# EAGLE design RamBoard (EAGLE 5.11)
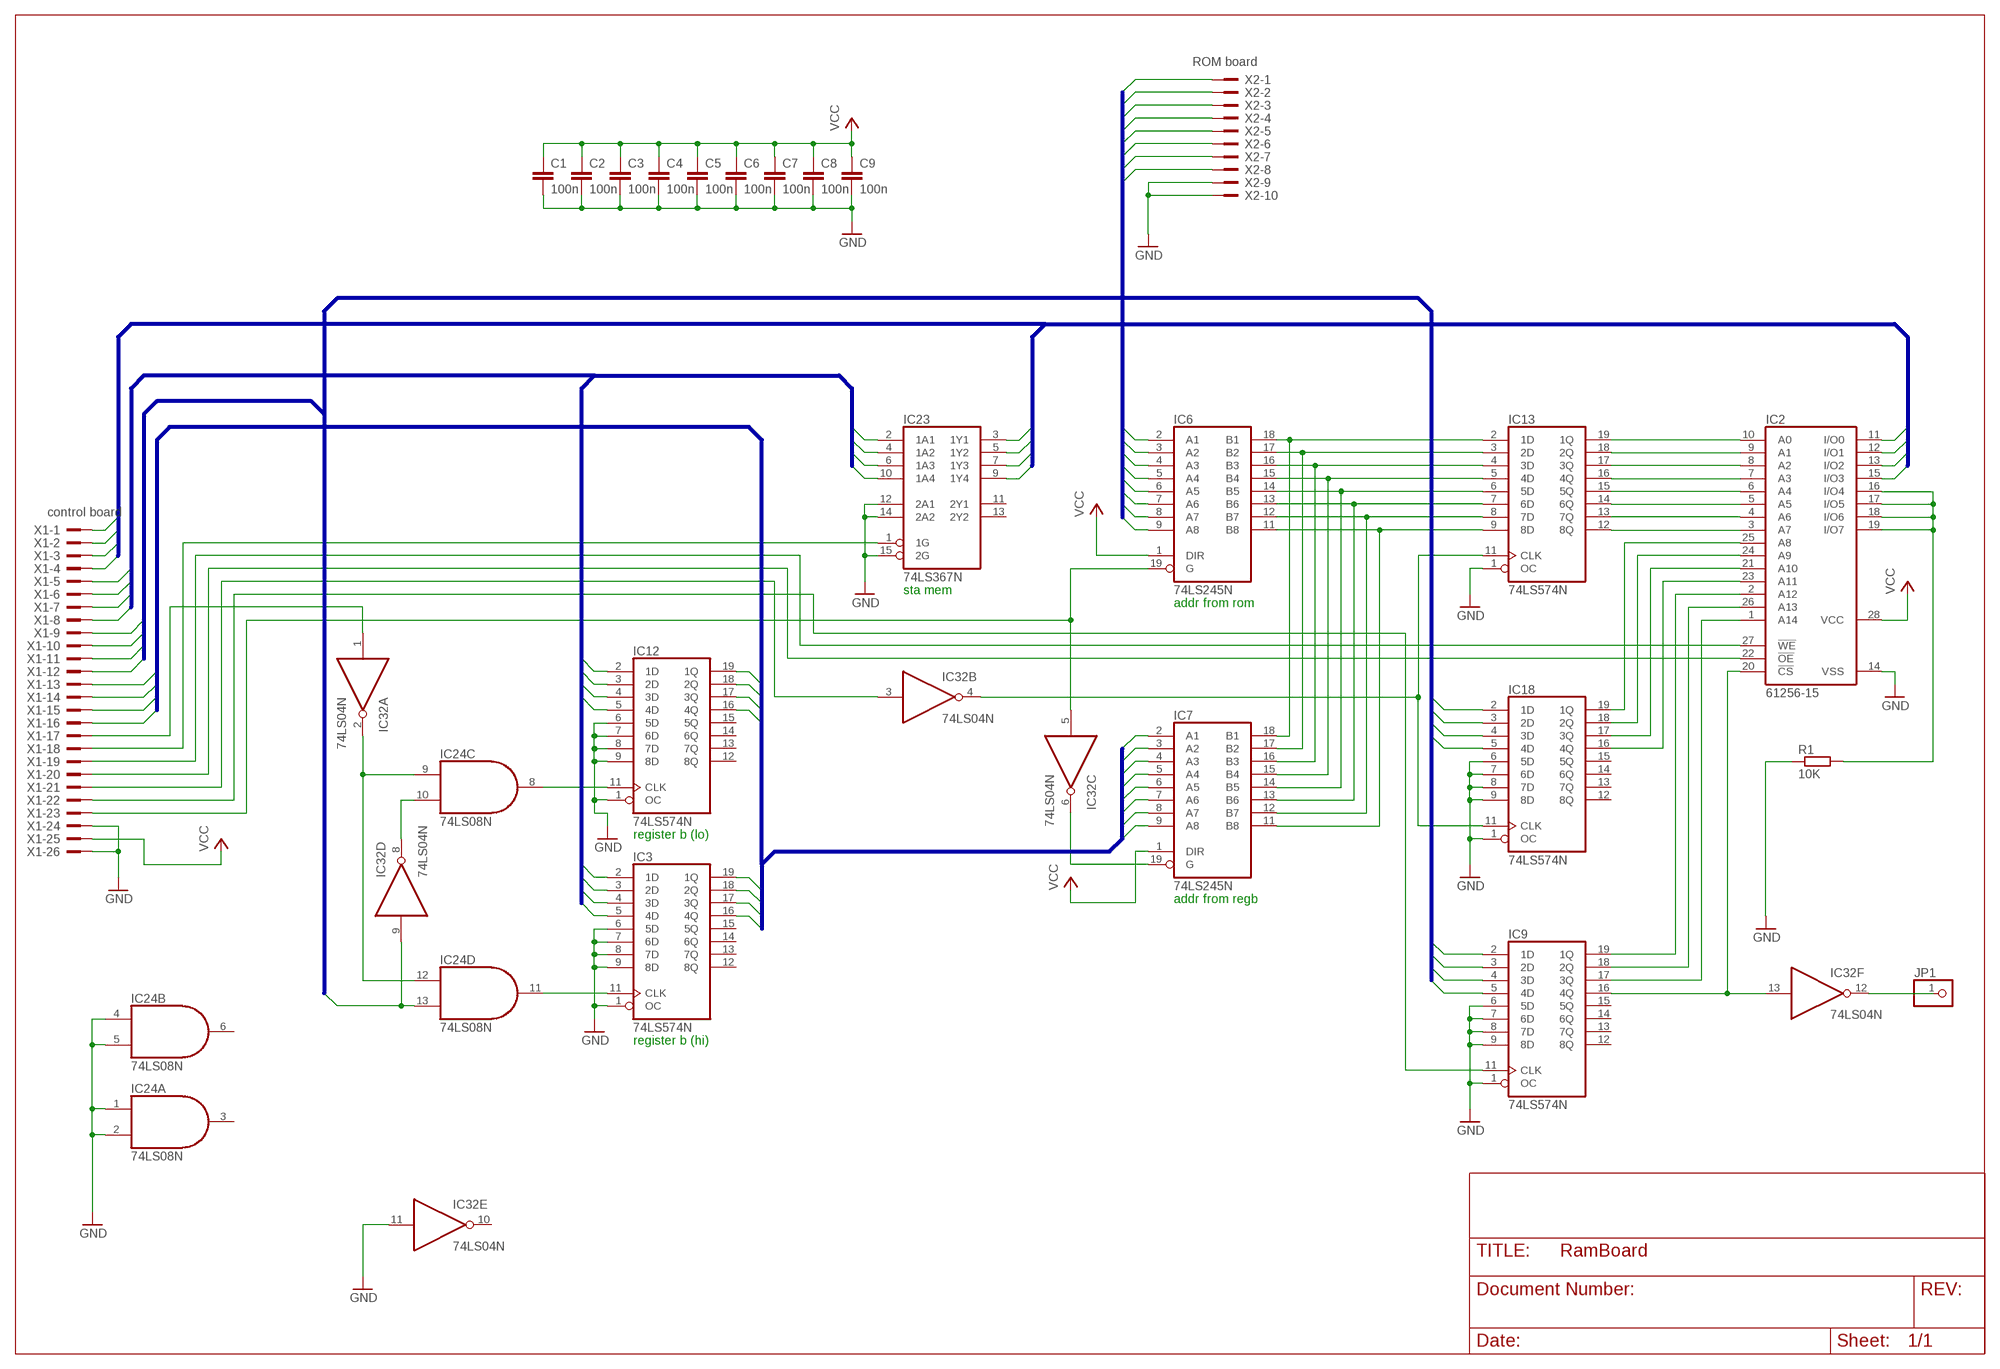
[diagram p0: schematic, sheet 1]

## Parts
C1  100n  C-EU050-025X075  [C050-025X075]
C2  100n  C-EU050-025X075  [C050-025X075]
C3  100n  C-EU050-025X075  [C050-025X075]
C4  100n  C-EU050-025X075  [C050-025X075]
C5  100n  C-EU050-025X075  [C050-025X075]
C6  100n  C-EU050-025X075  [C050-025X075]
C7  100n  C-EU050-025X075  [C050-025X075]
C8  100n  C-EU050-025X075  [C050-025X075]
C9  100n  C-EU050-025X075  [C050-025X075]
IC2  61256-15  62832P  [DIL28-3]
IC3  74LS574N  74AS574N  [DIL20]
IC6  74LS245N  [DIL20]
IC7  74LS245N  [DIL20]
IC9  74LS574N  74AS574N  [DIL20]
IC12  74LS574N  74AS574N  [DIL20]
IC13  74LS574N  74AS574N  [DIL20]
IC18  74LS574N  74AS574N  [DIL20]
IC23  74LS367N  74367N  [DIL16]
IC24  74LS08N  [DIL14]
IC32  74LS04N  [DIL14]
JP1  PINHD-1X1  [1X01]
R1  10K  R-EU_0207/10  [0207/10]
X1  control board  2526-  [PAK100/2500-26]
X2  ROM board  2510-  [PAK100/2500-10]

## Nets
/ADDR_FROM_REGB: IC7.19(G) IC32.6(C:O)
/CS0: IC2.20(!CS) IC9.16(4Q) IC32.13(F:I)
/CS1: IC32.12(F:O) JP1.1
/IMM0: IC24.10(C:I1) IC32.8(D:O)
/LOAD_MEMADDR: IC32.3(B:I) X1.21
/LOAD_REGB: IC32.1(A:I) X1.17
/RAM_OE: IC2.22(!OE) X1.20
/RAM_WE: IC2.27(!WE) X1.19
/STA_MEM: IC23.1(1G) X1.18
ACCOUT0: IC3.2(1D) IC12.2(1D) IC23.2(1A1) X1.5
ACCOUT1: IC3.3(2D) IC12.3(2D) IC23.4(1A2) X1.6
ACCOUT2: IC3.4(3D) IC12.4(3D) IC23.6(1A3) X1.7
ACCOUT3: IC3.5(4D) IC12.5(4D) IC23.10(1A4) X1.8
ADDR_FROM_REGB: IC6.19(G) IC32.5(C:I) X1.23
GND: C1.2 C2.2 C3.2 C4.2 C5.2 C6.2 C7.2 C8.2 C9.2 IC2.14(VSS) IC3.1(OC) IC3.6(5D) IC3.7(6D) IC3.8(7D) IC3.9(8D) IC9.1(OC) IC9.6(5D) IC9.7(6D) IC9.8(7D) IC9.9(8D) IC12.1(OC) IC12.6(5D) IC12.7(6D) IC12.8(7D) IC12.9(8D) IC13.1(OC) IC18.1(OC) IC18.6(5D) IC18.7(6D) IC18.8(7D) IC18.9(8D) IC23.12(2A1) IC23.14(2A2) IC23.15(2G) IC24.1(A:I0) IC24.2(A:I1) IC24.4(B:I0) IC24.5(B:I1) IC32.11(E:I) R1.1 X1.24 X1.26 X2.9 X2.10
IMM0: IC9.2(1D) IC18.2(1D) IC24.13(D:I1) IC32.9(D:I) X1.9
IMM1: IC9.3(2D) IC18.3(2D) X1.10
IMM2: IC9.4(3D) IC18.4(3D) X1.11
IMM3: IC9.5(4D) IC18.5(4D) X1.12
LOAD_MEMADDR: IC13.11(CLK) IC18.11(CLK) IC32.4(B:O)
LOAD_MEMADDR_H: IC9.11(CLK) X1.22
LOAD_RAM_A0: IC6.18(B1) IC7.18(B1) IC13.2(1D)
LOAD_RAM_A1: IC6.17(B2) IC7.17(B2) IC13.3(2D)
LOAD_RAM_A2: IC6.16(B3) IC7.16(B3) IC13.4(3D)
LOAD_RAM_A3: IC6.15(B4) IC7.15(B4) IC13.5(4D)
LOAD_RAM_A4: IC6.14(B5) IC7.14(B5) IC13.6(5D)
LOAD_RAM_A5: IC6.13(B6) IC7.13(B6) IC13.7(6D)
LOAD_RAM_A6: IC6.12(B7) IC7.12(B7) IC13.8(7D)
LOAD_RAM_A7: IC6.11(B8) IC7.11(B8) IC13.9(8D)
LOAD_REGB: IC24.9(C:I0) IC24.12(D:I0) IC32.2(A:O)
LOAD_REGB_HI: IC3.11(CLK) IC24.11(D:O)
LOAD_REGB_LO: IC12.11(CLK) IC24.8(C:O)
N$1: IC2.10(A0) IC13.19(1Q)
N$2: IC2.2(A12) IC9.19(1Q)
N$3: IC2.9(A1) IC13.18(2Q)
N$4: IC2.26(A13) IC9.18(2Q)
N$5: IC2.8(A2) IC13.17(3Q)
N$6: IC2.7(A3) IC13.16(4Q)
N$7: IC2.6(A4) IC13.15(5Q)
N$8: IC2.5(A5) IC13.14(6Q)
N$9: IC2.4(A6) IC13.13(7Q)
N$10: IC2.3(A7) IC13.12(8Q)
N$13: IC2.25(A8) IC18.19(1Q)
N$14: IC2.24(A9) IC18.18(2Q)
N$15: IC2.1(A14) IC9.17(3Q)
N$17: IC2.21(A10) IC18.17(3Q)
N$18: IC2.23(A11) IC18.16(4Q)
RAM_IO0: IC2.11(I/O0) IC23.3(1Y1) X1.1
RAM_IO1: IC2.12(I/O1) IC23.5(1Y2) X1.2
RAM_IO2: IC2.13(I/O2) IC23.7(1Y3) X1.3
RAM_IO3: IC2.15(I/O3) IC23.9(1Y4) X1.4
RAM_IO4..7: IC2.16(I/O4) IC2.17(I/O5) IC2.18(I/O6) IC2.19(I/O7) R1.2
REGB0: IC7.2(A1) IC12.19(1Q) X1.13
REGB1: IC7.3(A2) IC12.18(2Q) X1.14
REGB2: IC7.4(A3) IC12.17(3Q) X1.15
REGB3: IC7.5(A4) IC12.16(4Q) X1.16
REGB4: IC3.19(1Q) IC7.6(A5)
REGB5: IC3.18(2Q) IC7.7(A6)
REGB6: IC3.17(3Q) IC7.8(A7)
REGB7: IC3.16(4Q) IC7.9(A8)
ROM_O0: IC6.2(A1) X2.1
ROM_O1: IC6.3(A2) X2.2
ROM_O2: IC6.4(A3) X2.3
ROM_O3: IC6.5(A4) X2.4
ROM_O4: IC6.6(A5) X2.5
ROM_O5: IC6.7(A6) X2.6
ROM_O6: IC6.8(A7) X2.7
ROM_O7: IC6.9(A8) X2.8
VCC: C1.1 C2.1 C3.1 C4.1 C5.1 C6.1 C7.1 C8.1 C9.1 IC2.28(VCC) IC6.1(DIR) IC7.1(DIR) X1.25
Unconnected: IC3.12(8Q) IC3.13(7Q) IC3.14(6Q) IC3.15(5Q) IC9.12(8Q) IC9.13(7Q) IC9.14(6Q) IC9.15(5Q) IC12.12(8Q) IC12.13(7Q) IC12.14(6Q) IC12.15(5Q) IC18.12(8Q) IC18.13(7Q) IC18.14(6Q) IC18.15(5Q) IC23.11(2Y1) IC23.13(2Y2) IC24.3(A:O) IC24.6(B:O) IC32.10(E:O)

## Buses
ROM_O[0..7]
RAM_IO[0..3]
ACCOUT[0..3]
REGB[0..7]
IMM[0..3]

## Notes on the sheet
- sta mem
- addr from rom
- register b (lo)
- addr from regb
- register b (hi)

## Power pins joined to a net without a drawn wire
GND: IC3.10(GND) IC6.10(GND) IC7.10(GND) IC9.10(GND) IC12.10(GND) IC13.10(GND) IC18.10(GND) IC23.8(GND) IC24.7(P:GND) IC32.7(P:GND)
VCC: IC3.20(VCC) IC6.20(VCC) IC7.20(VCC) IC9.20(VCC) IC12.20(VCC) IC13.20(VCC) IC18.20(VCC) IC23.16(VCC) IC24.14(P:VCC) IC32.14(P:VCC)

## Library data of the parts
C1-C9 = rcl:C-EU: CAPACITOR, European symbol
IC2 = memory-hitachi:62832P: MEMORY; OC_FARNELL: unknown; OC_NEWARK: unknown
IC3 IC9 IC12 IC13 IC18 = 74xx-us:74*574: 8-bit D type FLIP FLOP bus driver
IC6 IC7 = 74xx-us:74*245: Octal BUS TRANSCEIVER, 3-state
IC23 = 74xx-us:74*367: Hex BUS DRIVER, 3-state
IC24 = 74xx-us:74*08: Quad 2-input AND gate
IC32 = 74xx-us:74*04: Hex INVERTER
JP1 = pinhead:PINHD-1X1: PIN HEADER
R1 = rcl:R-EU_: RESISTOR, European symbol
X1 = con-3m:2526-: 3M (TM) Pak 100 4-Wall Header Source: 3M; OC_FARNELL: unknown; OC_NEWARK: unknown
X2 = con-3m:2510-: 3M (TM) Pak 100 4-Wall Header Source: 3M; MF: 3M; MPN: 2510-6002UB; OC_FARNELL: 9838244; OC_NEWARK: 46F4725

## Board
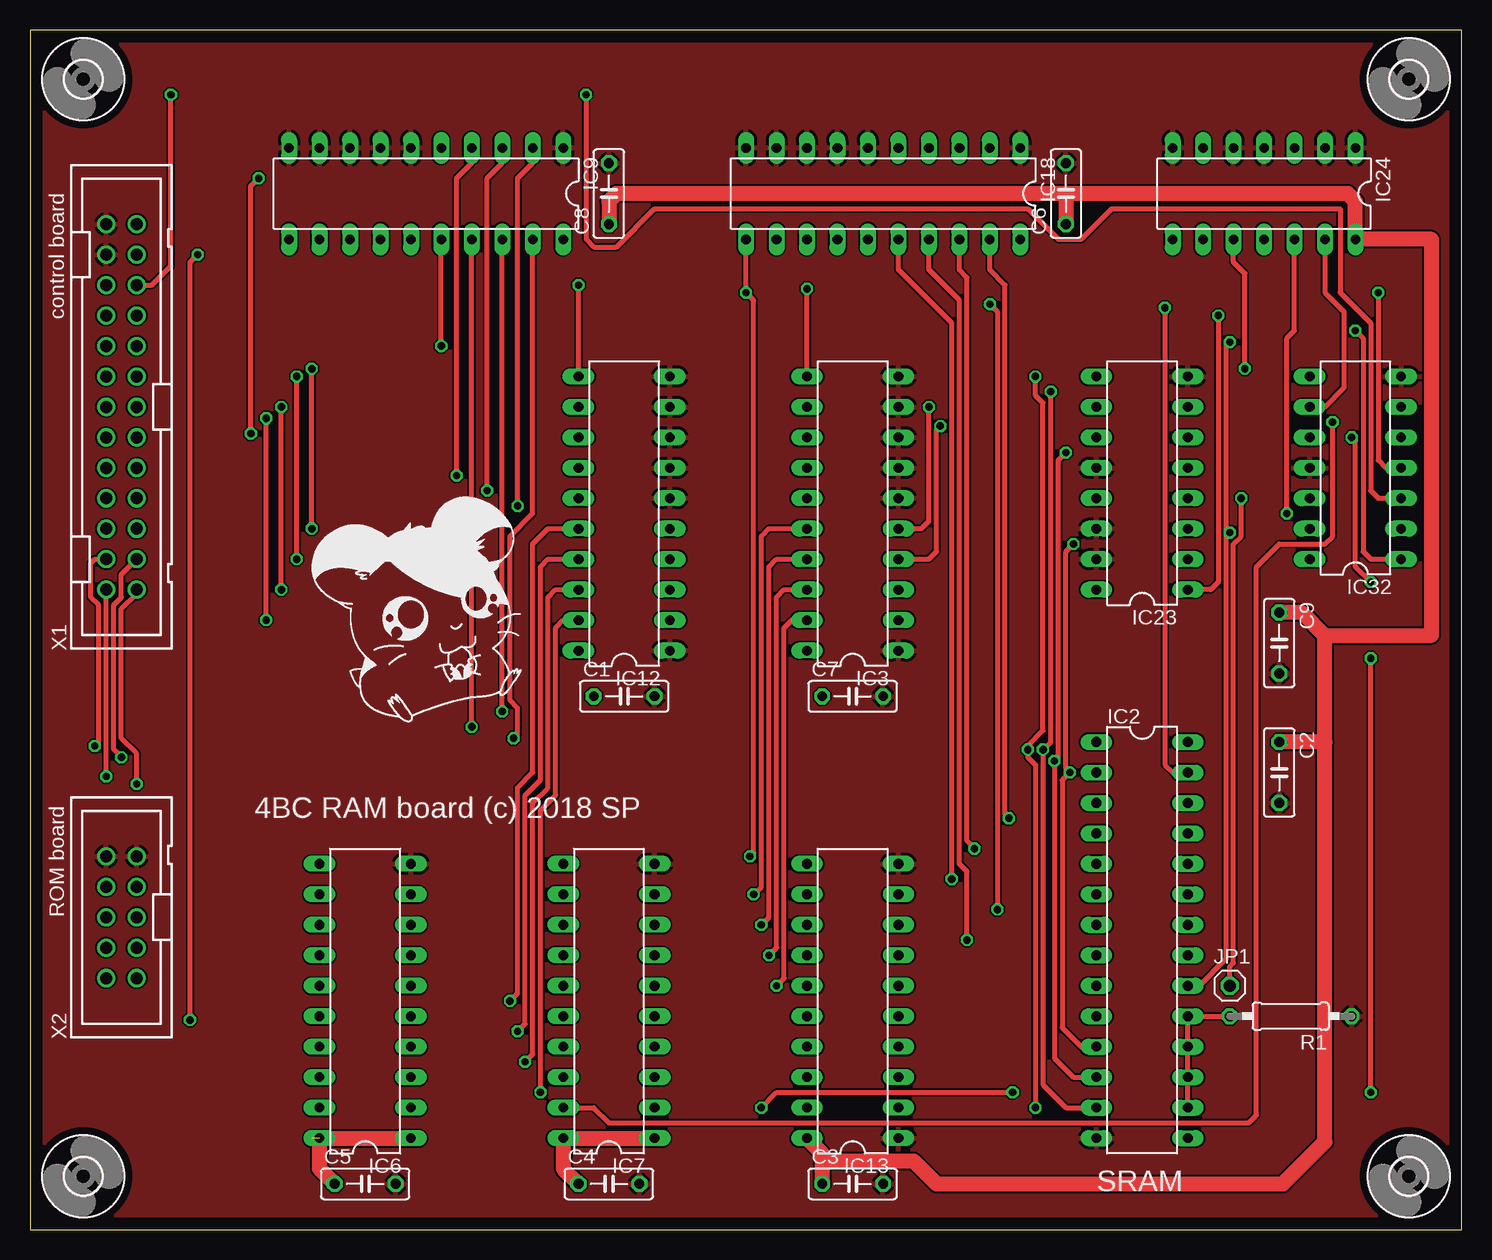
[diagram p1: board, top side]
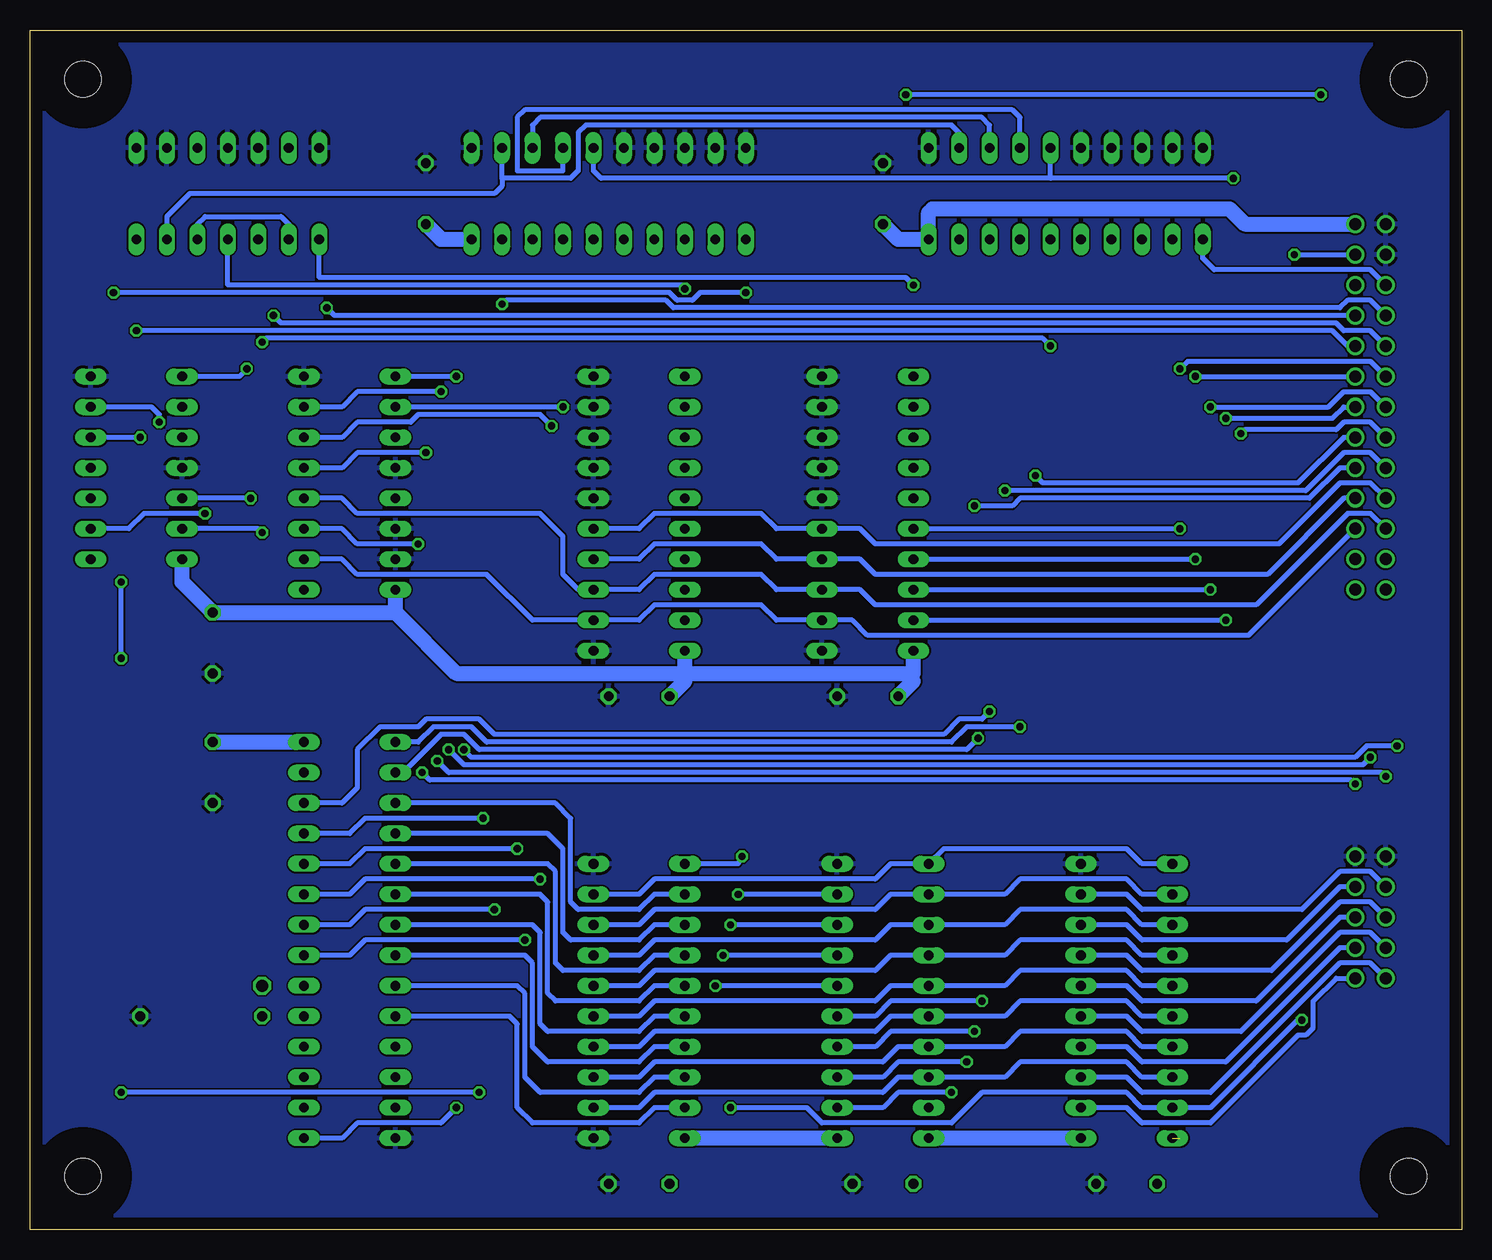
[diagram p2: board, bottom side, seen from below]

Size 119.36 x 100 mm. Coordinates in mm from the lower left corner, seen from the top.
Outline: 0,0 119.36,0 119.36,100 0,100 0,0
Copper layers (1*16): Top 0.035mm / dielectric 1.5mm / Bottom 0.035mm
Design rules "default *": minimum track width 10mil, minimum drill 16mil, track to track 6mil, track to pad 6mil, pad to pad 8mil, via to via 8mil, smd to smd 8mil, copper to edge 40mil, drill to drill 8mil, minimum pad ring 10mil, minimum via ring 8mil, stop-mask expansion 4mil, vias tented up to drill 0mil, thermal gap 10mil

### Footprints (pad centres in the part's own frame; a part is rotated, then mirrored left to right if it is on the bottom)
C050-025X075 = drill 0.813 octagon: 1 -2.54,0; 2 2.54,0
DIL28-3 = drill 0.813 long: 1 -16.51,-3.81; 2 -13.97,-3.81; 3 -11.43,-3.81; 4 -8.89,-3.81; 5 -6.35,-3.81; 6 -3.81,-3.81; 7 -1.27,-3.81; 8 1.27,-3.81; 9 3.81,-3.81; 10 6.35,-3.81; 11 8.89,-3.81; 12 11.43,-3.81; 13 13.97,-3.81; 14 16.51,-3.81; 15 16.51,3.81; 16 13.97,3.81; 17 11.43,3.81; 18 8.89,3.81; 19 6.35,3.81; 20 3.81,3.81; 21 1.27,3.81; 22 -1.27,3.81; 23 -3.81,3.81; 24 -6.35,3.81; 25 -8.89,3.81; 26 -11.43,3.81; 27 -13.97,3.81; 28 -16.51,3.81
DIL20 = drill 0.813 long: 1 -11.43,-3.81; 2 -8.89,-3.81; 3 -6.35,-3.81; 4 -3.81,-3.81; 5 -1.27,-3.81; 6 1.27,-3.81; 7 3.81,-3.81; 8 6.35,-3.81; 9 8.89,-3.81; 10 11.43,-3.81; 11 11.43,3.81; 12 8.89,3.81; 13 6.35,3.81; 14 3.81,3.81; 15 1.27,3.81; 16 -1.27,3.81; 17 -3.81,3.81; 18 -6.35,3.81; 19 -8.89,3.81; 20 -11.43,3.81
DIL16 = drill 0.813 long: 1 -8.89,-3.81; 2 -6.35,-3.81; 3 -3.81,-3.81; 4 -1.27,-3.81; 5 1.27,-3.81; 6 3.81,-3.81; 7 6.35,-3.81; 8 8.89,-3.81; 9 8.89,3.81; 10 6.35,3.81; 11 3.81,3.81; 12 1.27,3.81; 13 -1.27,3.81; 14 -3.81,3.81; 15 -6.35,3.81; 16 -8.89,3.81
DIL14 = drill 0.813 long: 1 -7.62,-3.81; 2 -5.08,-3.81; 3 -2.54,-3.81; 4 0,-3.81; 5 2.54,-3.81; 6 5.08,-3.81; 7 7.62,-3.81; 8 7.62,3.81; 9 5.08,3.81; 10 2.54,3.81; 11 0,3.81; 12 -2.54,3.81; 13 -5.08,3.81; 14 -7.62,3.81
1X01 = drill 1.016 octagon: 1 0,0
0207/10 = drill 0.813 octagon: 1 -5.08,0; 2 5.08,0
3,0 = hole 3: 0,0
PAK100/2500-26 = drill 1 pad 1.422 round: 1 -15.24,-1.27; 2 -15.24,1.27; 3 -12.7,-1.27; 4 -12.7,1.27; 5 -10.16,-1.27; 6 -10.16,1.27; 7 -7.62,-1.27; 8 -7.62,1.27; 9 -5.08,-1.27; 10 -5.08,1.27; 11 -2.54,-1.27; 12 -2.54,1.27; 13 0,-1.27; 14 0,1.27; 15 2.54,-1.27; 16 2.54,1.27; 17 5.08,-1.27; 18 5.08,1.27; 19 7.62,-1.27; 20 7.62,1.27; 21 10.16,-1.27; 22 10.16,1.27; 23 12.7,-1.27; 24 12.7,1.27; 25 15.24,-1.27; 26 15.24,1.27
PAK100/2500-10 = drill 1 pad 1.422 round: 1 -5.08,-1.27; 2 -5.08,1.27; 3 -2.54,-1.27; 4 -2.54,1.27; 5 0,-1.27; 6 0,1.27; 7 2.54,-1.27; 8 2.54,1.27; 9 5.08,-1.27; 10 5.08,1.27

### Placement (x,y rotation side)
C1  49.53,44.45 0 top
C2  104.14,38.1 270 top
C3  68.58,3.81 0 top
C4  48.26,3.81 0 top
C5  27.94,3.81 0 top
C6  86.36,86.36 90 top
C7  68.58,44.45 0 top
C8  48.26,86.36 90 top
C9  104.14,48.9 270 top
IC2  92.71,24.13 270 top
IC3  68.58,59.69 90 top
IC6  27.94,19.05 90 top
IC7  48.26,19.05 90 top
IC9  33.02,86.36 180 top
IC12  49.53,59.69 90 top
IC13  68.58,19.05 90 top
IC18  71.12,86.36 180 top
IC23  92.71,62.23 90 top
IC24  102.87,86.36 180 top
IC32  110.49,63.5 90 top
JP1  100.01,20.32 0 top
R1  105.09,17.78 180 top
U$1  [3,0]  114.94,95.89 0 top
U$2  [3,0]  4.45,95.89 0 top
U$3  [3,0]  4.45,4.45 0 top
U$4  [3,0]  114.94,4.45 0 top
X1  7.62,68.58 90 top
X2  7.62,26.04 90 top

### Tracks (layer width: path | path; a pad name or v marks a point on that pad's centre or on a via)
/ADDR_FROM_REGB  (via drill 0.6)
  Top 0.406: IC7.19 46.99,10.16 48.26,8.89 101.6,8.89 102.23,9.53 102.23,55.24 104.14,57.15 107.95,57.15 108.58,57.78 v108.58,67.31
  Bottom 0.406: v108.58,67.31 108.58,67.94 109.22,68.58 IC32.6
/CS0  (via drill 0.6)
  Top 0.406: IC2.20 97.47,20.32 99.69,22.54 99.69,57.78 v100.01,58.1 99.69,58.42 99.69,73.66 v100.01,73.98 | v34.29,73.66 IC9.16
  Bottom 0.406: IC32.13 100.33,58.42 v100.01,58.1 | v34.29,73.66 34.92,74.3 99.69,74.3 v100.01,73.98
/CS1  (via drill 0.6)
  Top 0.406: JP1.1 100.01,21.91 100.33,22.23 100.33,57.15 100.97,57.78 v100.97,60.96
  Bottom 0.406: v100.97,60.96 IC32.12
/IMM0  (via drill 0.6)
  Top 0.406: v101.28,71.75 101.28,79.69 100.33,80.64 IC24.10
  Bottom 0.406: IC32.8 101.92,71.12 v101.28,71.75
/LOAD_MEMADDR  (via drill 0.6)
  Top 0.406: IC32.3 112.39,60.96 111.76,61.59 111.76,75.56 109.22,78.11 109.22,85.09 90.17,85.09 87.63,82.55 85.72,82.55 83.19,85.09 52.07,85.09 48.9,81.92 46.99,81.92 46.35,82.55 v46.35,94.61 | X1.21 10.16,78.74 11.75,80.33 v11.75,94.61
  Bottom 0.406: v11.75,94.61 v46.35,94.61
/LOAD_REGB  (via drill 0.6)
  Top 0.406: v110.49,74.93 111.12,74.3 111.12,56.52 111.76,55.88 IC32.1
  Bottom 0.406: v110.49,74.93 10.79,74.93 9.53,73.66 X1.17
/RAM_OE  (via drill 0.6)
  Top 0.406: v80.64,26.67 80.64,76.52 v80.01,77.15
  Bottom 0.406: IC2.22 92.71,25.4 91.44,26.67 v80.64,26.67 | v80.01,77.15 79.69,77.47 66.36,77.47 65.72,76.83 10.16,76.83 9.53,77.47 7.62,77.47 X1.20
/RAM_WE  (via drill 0.6)
  Top 0.406: v94.61,76.83 94.61,38.73 95.25,38.1 IC2.27
  Bottom 0.406: v94.61,76.83 93.98,76.2 X1.19
/STA_MEM  (via drill 0.6)
  Top 0.406: v99.06,76.2 99.06,53.98 98.42,53.34 IC23.1
  Bottom 0.406: v99.06,76.2 98.42,75.56 10.48,75.56 9.84,74.93 7.62,74.93 X1.18
ACCOUT0
  Bottom 0.406: IC23.2 93.34,55.88 92.08,54.61 81.28,54.61 77.47,50.8 IC3.2 68.58,50.8 67.31,52.07 58.42,52.07 57.15,50.8 IC12.2 50.8,50.8 49.53,49.53 17.78,49.53 X1.5
ACCOUT1
  Bottom 0.406: IC23.4 93.34,60.96 92.08,59.69 76.83,59.69 74.93,57.78 74.93,54.61 73.66,53.34 IC3.3 68.58,53.34 67.31,54.61 58.42,54.61 57.15,53.34 IC12.3 50.16,53.34 48.9,52.07 17.14,52.07 9.53,59.69 7.62,59.69 X1.6
ACCOUT2  (via drill 0.6)
  Top 0.406: v75.88,66.99 75.56,66.67 75.56,56.52 74.93,55.88 IC3.4
  Bottom 0.406: IC3.4 68.58,55.88 67.31,57.15 58.42,57.15 57.15,55.88 IC12.4 50.16,55.88 48.9,54.61 16.19,54.61 9.84,60.96 X1.7 | IC23.6 93.34,66.04 92.08,67.31 87.63,67.31 87,67.94 76.83,67.94 v75.88,66.99
ACCOUT3  (via drill 0.6)
  Top 0.406: v74.93,68.58 74.93,59.05 74.3,58.42 IC3.5
  Bottom 0.406: IC3.5 68.58,58.42 67.31,59.69 58.42,59.69 57.15,58.42 IC12.5 50.16,58.42 48.9,57.15 15.24,57.15 10.16,62.23 7.62,62.23 X1.8 | v74.93,68.58 IC23.10
ADDR_FROM_REGB  (via drill 0.6)
  Top 0.406: v13.34,17.46 13.34,80.64 v13.97,81.28 | v60.96,10.16 62.23,11.43 v81.92,11.43 | v111.76,53.98 110.49,55.24 110.49,65.72 v110.17,66.04 | v111.76,11.43 v111.76,47.62
  Bottom 0.406: v13.34,17.46 13.65,17.46 20.95,10.16 IC6.19 26.67,10.16 27.94,11.43 40.01,11.43 42.55,8.89 53.34,8.89 54.61,10.16 v60.96,10.16 | v81.92,11.43 v111.76,11.43 | v110.17,66.04 IC32.5 | v111.76,47.62 v111.76,53.98 | v13.97,81.28 X1.23
GND
  pour Bottom: 0,100.33 119.38,100.33 119.38,0 0,0
  pour Top: 0,99.69 119.38,99.69 119.38,0 0,0
IMM0  (via drill 0.6)
  Top 0.406: IC24.13 107.95,78.11 109.54,76.52 109.54,70.17 107.95,68.58 IC32.9 | IC9.2 41.91,88.9 40.64,87.63 v40.64,60.33
  Bottom 0.406: v40.64,60.33 37.47,60.33 36.83,60.96 12.7,60.96 10.16,63.5 X1.9 | IC24.13 107.95,84.45 106.05,86.36 80.64,86.36 80.01,87 80.01,87.63 | IC9.2 41.91,91.44 42.55,92.08 73.03,92.08 73.66,91.44 73.66,88.27 74.3,87.63 80.01,87.63 | 80.01,87.63 IC18.2
IMM1  (via drill 0.6)
  Top 0.406: IC9.3 39.37,88.9 38.1,87.63 v38.1,61.59
  Bottom 0.406: IC9.3 39.37,92.08 40.01,92.71 76.83,92.71 77.47,92.08 IC18.3 | v38.1,61.59 13.02,61.59 9.84,64.77 7.62,64.77 X1.10
IMM2  (via drill 0.6)
  Top 0.406: v35.56,62.87 35.56,87.63 36.83,88.9 IC9.4
  Bottom 0.406: v35.56,62.87 34.92,62.23 13.65,62.23 9.84,66.04 X1.11 | IC9.4 36.83,92.71 37.47,93.34 78.11,93.34 78.74,92.71 78.74,88.27 74.93,88.27 IC18.4
IMM3  (via drill 0.6)
  Top 0.406: v18.41,66.36 18.41,87 v19.05,87.63
  Bottom 0.406: IC18.5 72.39,88.27 71.75,87.63 34.29,87.63 | v19.05,87.63 34.29,87.63 | X1.12 7.62,67.31 9.84,67.31 10.48,66.67 18.1,66.67 v18.41,66.36 | 34.29,87.63 IC9.5
LOAD_MEMADDR  (via drill 0.6)
  Top 0.406: IC18.11 v59.69,78.11 60.33,77.47 60.33,31.43 v60.01,31.11 | v112.39,78.11 112.39,64.14 113.03,63.5 IC32.4
  Bottom 0.406: v59.69,78.11 63.5,78.11 64.14,77.47 65.41,77.47 66.04,78.11 v112.39,78.11 | IC13.11 60.33,30.48 v60.01,31.11
LOAD_MEMADDR_H
  Bottom 0.406: X1.22 7.62,80.01 20.64,80.01 21.59,80.96 IC9.11
LOAD_RAM_A0
  Bottom 0.406: IC6.18 26.67,12.7 27.94,13.97 36.83,13.97 38.1,12.7 IC7.18 46.99,12.7 48.26,11.43 67.31,11.43 68.58,10.16 IC13.2
LOAD_RAM_A1
  Bottom 0.406: IC6.17 26.67,15.24 27.94,16.51 36.83,16.51 38.1,15.24 IC7.17 46.99,15.24 48.26,13.97 67.31,13.97 68.58,12.7 IC13.3
LOAD_RAM_A2
  Bottom 0.406: IC6.16 26.67,17.78 27.94,19.05 36.83,19.05 38.1,17.78 IC7.16 47.62,17.78 48.9,16.51 67.31,16.51 68.58,15.24 IC13.4
LOAD_RAM_A3
  Bottom 0.406: IC6.15 26.67,20.32 27.94,21.59 36.83,21.59 38.1,20.32 IC7.15 47.62,20.32 48.9,19.05 67.31,19.05 68.58,17.78 IC13.5
LOAD_RAM_A4
  Bottom 0.406: IC6.14 26.67,22.86 27.94,24.13 36.83,24.13 38.1,22.86 IC7.14 47.62,22.86 48.9,21.59 67.31,21.59 68.58,20.32 IC13.6
LOAD_RAM_A5
  Bottom 0.406: IC6.13 26.67,25.4 27.94,26.67 36.83,26.67 38.1,25.4 IC7.13 47.62,25.4 48.9,24.13 67.31,24.13 68.58,22.86 IC13.7
LOAD_RAM_A6
  Bottom 0.406: IC6.12 26.67,27.94 27.94,29.21 36.83,29.21 38.1,27.94 IC7.12 47.62,27.94 48.9,26.67 67.31,26.67 68.58,25.4 IC13.8
LOAD_RAM_A7
  Bottom 0.406: IC6.11 26.67,30.48 27.94,31.75 43.18,31.75 IC7.11 47.62,30.48 48.9,29.21 67.31,29.21 68.58,27.94 IC13.9
LOAD_REGB  (via drill 0.6)
  Top 0.406: IC24.12 105.41,74.93 104.78,74.3 v104.78,59.69
  Bottom 0.406: IC24.9 97.79,83.82 98.42,84.45 104.78,84.45 105.41,83.82 IC24.12 | v104.78,59.69 109.86,59.69 111.12,58.42 IC32.2
LOAD_REGB_HI  (via drill 0.6)
  Top 0.406: IC3.11 v64.77,78.42
  Bottom 0.406: IC24.11 102.87,78.74 65.09,78.74 v64.77,78.42
LOAD_REGB_LO  (via drill 0.6)
  Top 0.406: IC12.11 v45.72,78.74
  Bottom 0.406: IC24.8 95.25,79.38 46.35,79.38 v45.72,78.74
N$1
  Bottom 0.406: IC13.19 67.31,10.16 68.58,8.89 77.47,8.89 78.74,10.16 78.74,17.14 79.38,17.78 IC2.10
N$2  (via drill 0.6)
  Top 0.406: IC9.19 41.91,59.69 40.01,57.78 40.01,44.13 40.64,43.5 40.64,41.27 v40.32,40.96
  Bottom 0.406: IC2.2 88.27,38.1 85.09,41.27 83.19,41.27 81.92,40.01 41.27,40.01 v40.32,40.96
N$3
  Bottom 0.406: IC13.18 67.31,12.7 68.58,11.43 76.83,11.43 78.11,12.7 78.11,19.68 78.74,20.32 IC2.9
N$4  (via drill 0.6)
  Top 0.406: v39.37,43.18 IC9.18
  Bottom 0.406: IC2.26 93.34,35.56 92.08,36.83 92.08,40.01 90.17,41.91 87,41.91 86.36,42.55 81.92,42.55 80.64,41.27 43.18,41.27 41.91,42.55 40.01,42.55 v39.37,43.18
N$5
  Bottom 0.406: IC13.17 67.31,15.24 68.58,13.97 76.2,13.97 77.47,15.24 77.47,22.23 78.11,22.86 IC2.8
N$6
  Bottom 0.406: IC13.16 67.31,17.78 68.58,16.51 76.2,16.51 76.83,17.14 76.83,24.77 77.47,25.4 IC2.7
N$7
  Bottom 0.406: IC13.15 67.31,20.32 68.58,19.05 75.56,19.05 76.2,19.68 76.2,27.3 76.83,27.94 IC2.6
N$8
  Bottom 0.406: IC13.14 67.31,22.86 68.58,21.59 74.93,21.59 75.56,22.23 75.56,29.84 76.2,30.48 IC2.5
N$9
  Bottom 0.406: IC13.13 67.31,25.4 68.58,24.13 74.3,24.13 74.93,24.77 74.93,31.75 76.2,33.02 IC2.4
N$10
  Bottom 0.406: IC13.12 67.31,27.94 68.58,26.67 73.66,26.67 74.3,27.3 74.3,34.29 75.56,35.56 IC2.3
N$13  (via drill 0.6)
  Top 0.406: v81.6,34.29 81.28,34.61 81.28,78.74 80.01,80.01 IC18.19
  Bottom 0.406: IC2.25 92.71,33.02 91.44,34.29 v81.6,34.29
N$14  (via drill 0.6)
  Top 0.406: v78.74,31.75 78.11,32.38 78.11,79.38 77.47,80.01 IC18.18
  Bottom 0.406: IC2.24 92.71,30.48 91.44,31.75 v78.74,31.75
N$15  (via drill 0.6)
  Top 0.406: v36.83,41.91 IC9.17
  Bottom 0.406: IC2.1 87,40.64 85.72,41.91 82.55,41.91 81.28,40.64 42.55,40.64 41.27,41.91 v36.83,41.91
N$17  (via drill 0.6)
  Top 0.406: IC18.17 74.93,80.01 77.47,77.47 77.47,30.48 78.11,29.84 v78.11,24.13
  Bottom 0.406: v78.11,24.13 91.44,24.13 92.71,22.86 IC2.21
N$18  (via drill 0.6)
  Top 0.406: v76.83,29.21 76.83,75.56 72.39,80.01 IC18.16
  Bottom 0.406: IC2.23 92.71,27.94 91.44,29.21 v76.83,29.21
RAM_IO0  (via drill 0.6)
  Top 0.406: IC2.11 87.63,15.24 86.04,16.83 86.04,37.47 v86.68,38.1 86.36,38.42 86.36,56.52 v87,57.15 | v8.89,37.15 8.89,39.69 7.62,40.96 7.62,51.75 8.89,53.02 X1.1
  Bottom 0.406: v86.68,38.1 86.04,37.47 9.21,37.47 v8.89,37.15 | v87,57.15 92.08,57.15 93.34,58.42 IC23.3
RAM_IO1  (via drill 0.6)
  Top 0.406: IC2.12 87,12.7 85.41,14.29 v85.41,39.05 85.72,39.37 85.72,64.14 v86.36,64.77 | v6.35,37.78 X1.2
  Bottom 0.406: v86.36,64.77 92.08,64.77 93.34,63.5 IC23.5 | v85.41,39.05 84.45,38.1 6.67,38.1 v6.35,37.78
RAM_IO2  (via drill 0.6)
  Top 0.406: IC2.13 86.36,10.16 84.45,12.06 v84.45,40.01 85.09,40.64 v85.09,69.85 | v7.62,39.37 6.99,40.01 6.99,52.07 7.62,52.7 7.62,54.61 X1.3
  Bottom 0.406: v84.45,40.01 83.19,38.73 8.26,38.73 v7.62,39.37 | v85.09,69.85 92.08,69.85 93.34,68.58 IC23.7
RAM_IO3  (via drill 0.6)
  Top 0.406: v83.82,71.12 83.82,69.53 84.45,68.9 84.45,41.59 83.19,40.32 v83.19,40.01 83.19,39.37 83.82,38.73 v83.82,10.16 | v5.4,40.32 5.71,40.64 5.71,52.07 5.08,52.7 5.08,55.56 5.4,55.88 X1.4
  Bottom 0.406: v83.19,40.01 82.55,39.37 8.89,39.37 7.94,40.32 v5.4,40.32 | v83.82,71.12 IC23.9 | IC2.15 93.34,7.62 92.08,8.89 85.09,8.89 v83.82,10.16
RAM_IO4..7
  Top 0.406: R1.2 IC2.19 IC2.18 IC2.17 IC2.16
REGB0  (via drill 0.6)
  Top 0.406: IC12.19 44.45,50.8 43.81,50.16 43.81,36.2 42.55,34.92 v42.55,11.43 | v19.68,50.8 v19.68,67.63
  Bottom 0.406: IC7.2 48.26,10.16 46.99,11.43 v42.55,11.43 | IC12.19 v19.68,50.8 | v19.68,67.63 10.79,67.63 9.84,68.58 X1.13
REGB1  (via drill 0.6)
  Top 0.406: IC12.18 43.81,53.34 43.18,52.7 43.18,36.83 41.91,35.56 41.91,14.61 v41.27,13.97 | v20.95,53.34 v20.95,68.58
  Bottom 0.406: v41.27,13.97 46.99,13.97 48.26,12.7 IC7.3 | IC12.18 v20.95,53.34 | v20.95,68.58 11.11,68.58 9.84,69.85 7.62,69.85 X1.14
REGB2  (via drill 0.6)
  Top 0.406: v40.64,16.51 41.27,17.14 41.27,36.2 42.55,37.47 42.55,55.24 43.18,55.88 IC12.17 | v22.23,55.88 v22.23,71.12
  Bottom 0.406: IC7.4 48.9,15.24 47.62,16.51 v40.64,16.51 | IC12.17 v22.23,55.88 | v22.23,71.12 X1.15
REGB3  (via drill 0.6)
  Top 0.406: v40.01,19.05 40.64,19.68 40.64,36.83 41.91,38.1 41.91,57.15 43.18,58.42 IC12.16 | v23.5,58.42 v23.5,71.75
  Bottom 0.406: IC7.5 48.9,17.78 47.62,19.05 v40.01,19.05 | IC12.16 v23.5,58.42 | v23.5,71.75 22.86,72.39 7.62,72.39 X1.16
REGB4  (via drill 0.6)
  Top 0.406: IC3.19 63.5,50.8 62.87,50.16 62.87,20.95 v62.23,20.32
  Bottom 0.406: IC7.6 v62.23,20.32
REGB5  (via drill 0.6)
  Top 0.406: IC3.18 62.87,53.34 62.23,52.7 62.23,23.5 v61.59,22.86
  Bottom 0.406: IC7.7 v61.59,22.86
REGB6  (via drill 0.6)
  Top 0.406: IC3.17 62.23,55.88 61.59,55.24 61.59,26.04 v60.96,25.4
  Bottom 0.406: IC7.8 v60.96,25.4
REGB7  (via drill 0.6)
  Top 0.406: v60.33,27.94 60.96,28.57 60.96,57.78 61.59,58.42 IC3.16
  Bottom 0.406: IC7.9 v60.33,27.94
ROM_O0
  Bottom 0.406: IC6.2 27.94,10.16 26.67,8.89 20.95,8.89 13.65,16.19 13.02,16.19 12.38,16.83 12.38,19.05 10.48,20.95 X2.1
ROM_O1
  Bottom 0.406: IC6.3 27.94,12.7 26.67,11.43 20.95,11.43 10.16,22.23 7.62,22.23 X2.2
ROM_O2
  Bottom 0.406: IC6.4 27.94,15.24 26.67,13.97 19.68,13.97 10.16,23.5 X2.3
ROM_O3
  Bottom 0.406: IC6.5 27.94,17.78 26.67,16.51 18.41,16.51 10.16,24.77 7.62,24.77 X2.4
ROM_O4
  Bottom 0.406: IC6.6 27.94,20.32 26.67,19.05 17.14,19.05 10.16,26.04 X2.5
ROM_O5
  Bottom 0.406: IC6.7 27.94,22.86 26.67,21.59 15.88,21.59 10.16,27.3 7.62,27.3 X2.6
ROM_O6
  Bottom 0.406: IC6.8 27.94,25.4 26.67,24.13 14.61,24.13 10.16,28.57 X2.7
ROM_O7
  Bottom 0.406: IC6.9 27.94,27.94 26.67,26.67 13.34,26.67 10.16,29.84 7.62,29.84 X2.8
VCC  (1 unrouted)
  Top 1.27: IC6.20 24.13,5.08 C5.1 | 23.5,7.62 IC6.1 | 66.04,5.71 66.04,6.35 IC13.20 | C4.1 44.45,5.08 IC7.20 IC7.1 | 107.95,40.64 107.95,49.53 | 107.95,49.53 106.05,51.44 C9.1 | 107.95,40.64 107.95,7.3 104.46,3.81 75.56,3.81 73.66,5.71 66.04,5.71 | 107.95,49.53 116.84,49.53 116.84,82.55 IC24.14 110.49,85.72 109.86,86.36 86.36,86.36 | 86.36,86.36 C6.1 | C8.1 48.26,85.72 48.9,86.36 86.36,86.36 | 107.95,40.64 C2.1 | 66.04,5.71 C3.1
  Bottom 1.016: 45.72,46.35 45.72,45.72 | 64.77,46.35 64.77,45.72 | 44.45,84.77 44.13,85.09
  Bottom 1.27: C6.1 85.09,82.55 IC18.20 | C8.1 46.99,82.55 IC9.20 44.45,84.77 | IC32.14 106.68,53.98 C9.1 88.9,51.44 | IC12.20 45.72,46.35 64.77,46.35 | 45.72,45.72 C1.1 | 64.77,45.72 C7.1 | 64.77,46.35 IC3.20 | C2.1 IC2.28 | 88.9,51.44 IC23.16 | 88.9,51.44 83.82,46.35 64.77,46.35 | X1.25 18.1,83.82 19.37,85.09 44.13,85.09 | IC6.1 IC7.20 | IC7.1 IC13.20

### Text on the board
tNames: control board | 4BC RAM board (c) 2018 SP | ROM board | SRAM | C:/Users/svpet/Pictures/ham_black_mono.bmp